# EAGLE schematic uno (EAGLE 6.1)
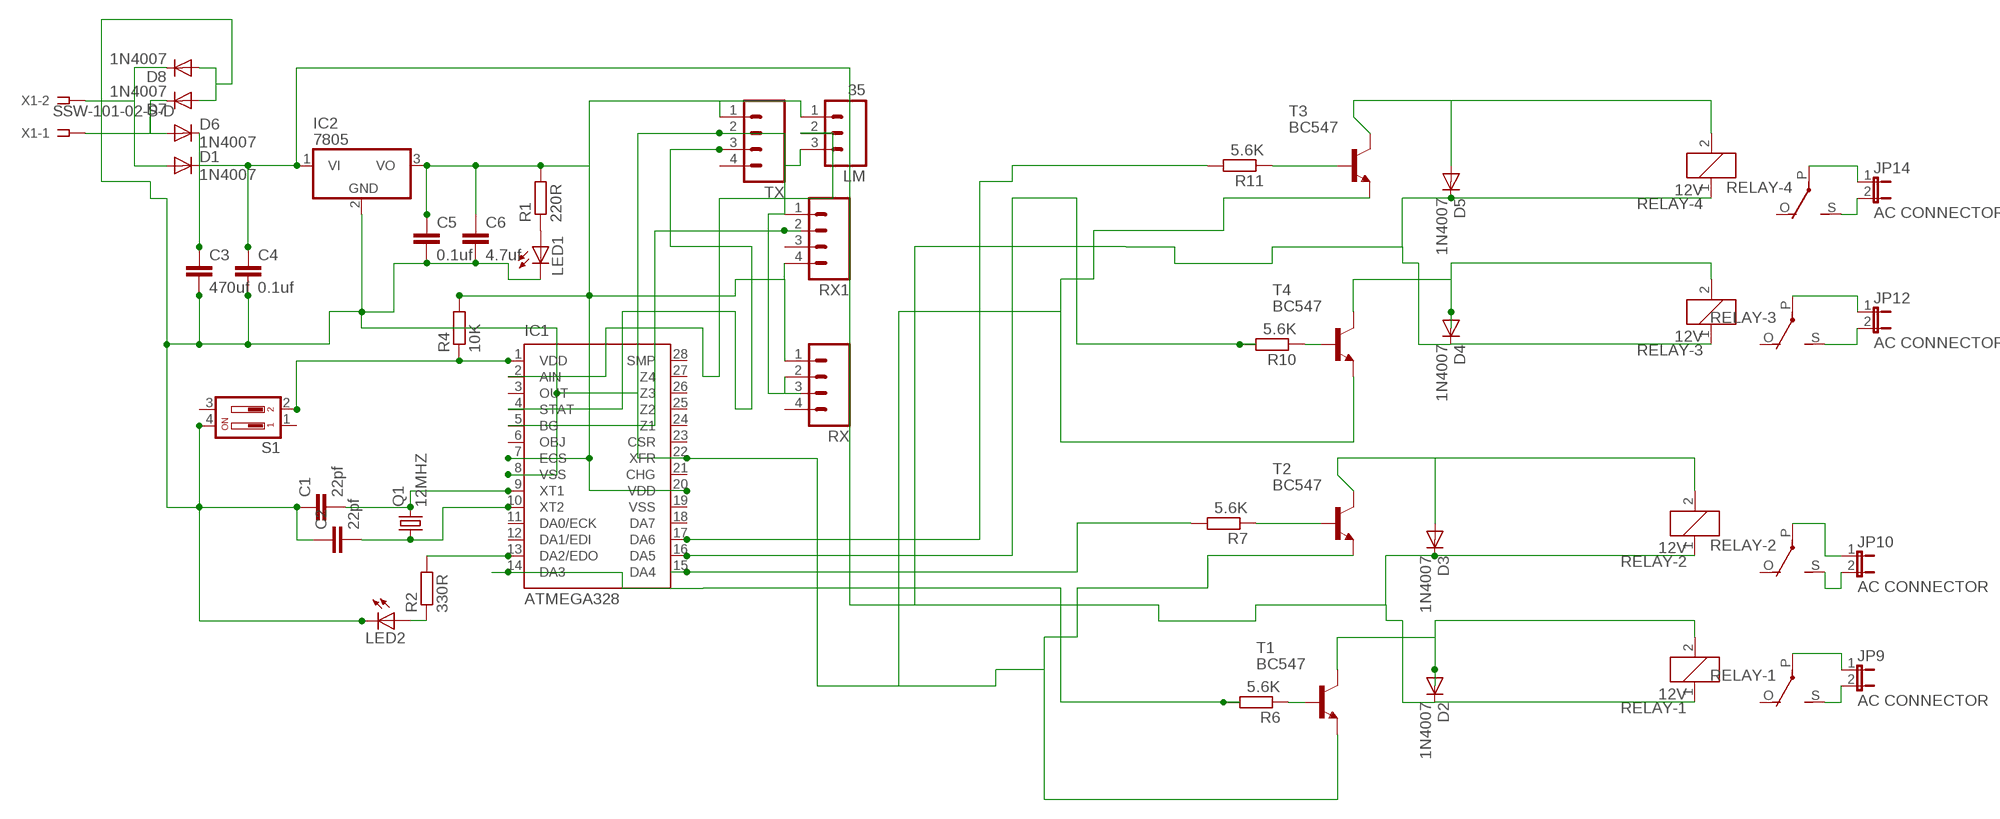
[diagram p0: schematic, sheet 1]

## Parts
C1  22pf  C2.5/2  [C2.5-2]
C2  22pf  C2.5/2  [C2.5-2]
C3  470uf  C2.5/2  [C2.5-2]
C4  0.1uf  C2.5/2  [C2.5-2]
C5  0.1uf  C2.5/2  [C2.5-2]
C6  4.7uf  C2.5/2  [C2.5-2]
D1  1N4007  1N4004  [DO41-10]
D2  1N4007  1N4004  [DO41-10]
D3  1N4007  1N4004  [DO41-10]
D4  1N4007  1N4004  [DO41-10]
D5  1N4007  1N4004  [DO41-10]
D6  1N4007  1N4004  [DO41-10]
D7  1N4007  1N4004  [DO41-10]
D8  1N4007  1N4004  [DO41-10]
IC1  ATMEGA328  QT9701BD  [DIL28-3]
IC2  7805  786TV  [TO220V]
JP9  AC CONNECTOR  JP1E  [JP1]
JP10  AC CONNECTOR  JP1E  [JP1]
JP12  AC CONNECTOR  JP1E  [JP1]
JP14  AC CONNECTOR  JP1E  [JP1]
LED1  LED3MM  [LED3MM]
LED2  LED3MM  [LED3MM]
LM  35  M03  [03P]
Q1  12MHZ  CRYSTALHC49S  [HC49/S]
R1  220R  R-EU_0207/10  [0207/10]
R2  330R  R-EU_0207/10  [0207/10]
R4  10K  R-EU_0207/10  [0207/10]
R6  5.6K  R-EU_0204/7  [0204/7]
R7  5.6K  R-EU_0204/7  [0204/7]
R10  5.6K  R-EU_0204/7  [0204/7]
R11  5.6K  R-EU_0204/7  [0204/7]
RELAY-1  12V  G5L  [G5LE]
RELAY-2  12V  G5L  [G5LE]
RELAY-3  12V  G5L  [G5LE]
RELAY-4  12V  G5L  [G5LE]
RX  M04  [04P]
RX1  M04  [04P]
S1  DP02  [DP-02]
T1  BC547  [TO92]
T2  BC547  [TO92]
T3  BC547  [TO92]
T4  BC547  [TO92]
TX  M04  [04P]
X1  SSW-101-02-S-D  [SSW-101-02-S-D]

## Nets
N$1: C1.2 IC1.9(XT1) Q1.2
N$2: C2.2 IC1.10(XT2) Q1.1
N$4: C5.1 C6.1 IC1.7(ECS) IC1.20(VDD) IC2.3(VO) LM.1 R1.2 R4.2 RX1.4 RX.1 TX.1
N$6: LED1.A R1.1
N$7: C3.1 C4.1 D1.C D2.C D3.C D4.C D5.C D6.C IC2.1(VI) RELAY-1.1 RELAY-2.1 RELAY-3.1 RELAY-4.1
N$8: IC1.2(AIN) LM.2
N$9: IC1.5(BG) RX1.2
N$10: D6.A D7.C X1.1
N$11: IC1.4(STAT) TX.3
N$12: D1.A D8.C X1.2
N$21: IC1.13(DA2/EDO) R2.2
N$28: D2.A RELAY-1.2 T1.3(C)
N$29: R7.1 T2.2(B)
N$30: R6.1 T1.2(B)
N$31: IC1.1(VDD) R4.1 S1.2
N$32: LED2.A R2.1
N$35: JP9.2 RELAY-1.S(2:S)
N$36: JP9.1 RELAY-1.P(2:P)
N$38: JP10.2 RELAY-2.S(2:S)
N$39: JP10.1 RELAY-2.P(2:P)
N$41: IC1.14(DA3) R6.2
N$42: D3.A RELAY-2.2 T2.3(C)
N$43: D4.A RELAY-3.2 T4.3(C)
N$45: R11.1 T3.2(B)
N$46: R10.1 T4.2(B)
N$49: JP12.2 RELAY-3.S(2:S)
N$50: JP12.1 RELAY-3.P(2:P)
N$51: JP14.2 RELAY-4.S(2:S)
N$53: JP14.1 RELAY-4.P(2:P)
N$55: C1.1 C2.1 C3.2 C4.2 C5.2 C6.2 D7.A D8.A IC1.8(VSS) IC1.22(XFR) IC2.2(GND) LED1.K(C) LED2.K(C) LM.3 RX1.1 RX.2 S1.4 T1.1(E) T2.1(E) T3.1(E) T4.1(E) TX.2
N$56: IC1.16(DA5) R10.2
N$57: IC1.17(DA6) R11.2
N$58: D5.A RELAY-4.2 T3.3(C)
N$59: IC1.15(DA4) R7.2
Unconnected: IC1.3(OUT) IC1.6(OBJ) IC1.11(DA0/ECK) IC1.12(DA1/EDI) IC1.18(DA7) IC1.19(VSS) IC1.21(CHG) IC1.23(CSR) IC1.24(Z1) IC1.25(Z2) IC1.26(Z3) IC1.27(Z4) IC1.28(SMP) RELAY-1.O(2:O) RELAY-2.O(2:O) RELAY-3.O(2:O) RELAY-4.O(2:O) RX1.3 RX.3 RX.4 S1.1 S1.3 TX.4

## Library data of the parts
C1-C6 = capacitor-wima:C: CAPACITOR naming: grid - package width
D1-D8 = diode:1N4004: DIODE general purpose rectifier, 1 A
IC1 = quantum-research-group:QT9701B: Charge-Transfer Capacitance Sensor IC Source: http://data.qprox.com/downloads/datasheets/qt9701b.pdf; OC_FARNELL: unknown; OC_NEWARK: unknown
IC2 = linear:78*: Positive VOLTAGE REGULATOR Source: http://cache.national.com/ds/LM/LM78L05.pdf http://www.fairchildsemi.com/ds/LM/LM7805.pdf
JP9 JP10 JP12 JP14 = jumper:JP1E: JUMPER
LED1 LED2 = led:LED: LED OSRAM: - CHIPLED LG R971, LG N971, LY N971, LG Q971, LY Q971, LO R971, LY R971 LH N974, LH R974 LS Q976, LO Q976, LY Q976 LO Q996 - Hyper CHIPLED LW Q18S LB Q993, LB Q99A, LB R99A - SideLED LS A670, LO A670, LY A670, LG A670, LP A670 LB A673, LV A673, LT A673, LW A673 LH A674 LY A675 LS A676, LA A676, LO A676, LY A676, LW A676 LS A679, LY A679, LG A679 - Hyper Micro SIDELED® LS Y876, LA Y876, LO Y876, LY Y876 LT Y87S - SmartLED LW L88C, LW L88S LB L89C, LB L89S, LG L890 LS L89K, LO L89K, LY L89K LS L896, LA L896, LO L896, LY L896 - TOPLED LS T670, LO T670, LY T670, LG T670, LP T670 LSG T670, LSP T670, LSY T670, LOP T670, LYG T670 LG T671, LOG T671, LSG T671 LB T673, LV T673, LT T673, LW T673 LH T674 LS T676, LA T676, LO T676, LY T676, LB T676, LH T676, LSB T676, LW T676 LB T67C, LV T67C, LT T67C, LS T67K, LO T67K, LY T67K, LW E67C LS E67B, LA E67B, LO E67B, LY E67B, LB E67C, LV E67C, LT E67C LW T67C LS T679, LY T679, LG T679 LS T770, LO T770, LY T770, LG T770, LP T770 LB T773, LV T773, LT T773, LW T773 LH T774 LS E675, LA E675, LY E675, LS T675 LS T776, LA T776, LO T776, LY T776, LB T776 LHGB T686 LT T68C, LB T68C - Hyper Mini TOPLED® LB M676 - Mini TOPLED Santana® LG M470 LS M47K, LO M47K, LY M47K Source: http://www.osram.convergy.de LUXEON: - LUMILED® LXK2-PW12-R00, LXK2-PW12-S00, LXK2-PW14-U00, LXK2-PW14-V00 LXK2-PM12-R00, LXK2-PM12-S00, LXK2-PM14-U00 LXK2-PE12-Q00, LXK2-PE12-R00, LXK2-PE12-S00, LXK2-PE14-T00, LXK2-PE14-U00 LXK2-PB12-K00, LXK2-PB12-L00, LXK2-PB12-M00, LXK2-PB14-N00, LXK2-PB14-P00, LXK2-PB14-Q00 LXK2-PR12-L00, LXK2-PR12-M00, LXK2-PR14-Q00, LXK2-PR14-R00 LXK2-PD12-Q00, LXK2-PD12-R00, LXK2-PD12-S00 LXK2-PH12-R00, LXK2-PH12-S00 LXK2-PL12-P00, LXK2-PL12-Q00, LXK2-PL12-R00 Source: www.luxeon.com KINGBRIGHT: KA-3528ASYC Source: www.kingbright.com
LM = con-amp-quick:M03: AMP QUICK CONNECTOR; OC_FARNELL: unknown; OC_NEWARK: unknown
Q1 = crystal:CRYSTAL: CRYSTAL; OC_FARNELL: 1667008; OC_NEWARK: unknown
R1 R2 R4 R6 R7 R10 R11 = rcl:R-EU_: RESISTOR, European symbol
RELAY-1-RELAY-4 = relay:G5L: RELAY 1 x switch, 10 A/120 V AC, 8 A/30 V ADC, Omron; OC_FARNELL: unknown; OC_NEWARK: unknown
RX RX1 TX = con-amp-quick:M04: AMP QUICK CONNECTOR; OC_FARNELL: unknown; OC_NEWARK: unknown
S1 = switch-dil:DP02: DIL/CODE SWITCH; MPN: MCDP02; OC_FARNELL: 1255233; OC_NEWARK: 26M1095
T1-T4 = transistor:BC547: NPN TRANSISTOR
X1 = con-samtec:SSW-101-02-S-D: THROUGH-HOLE .025" SQ POST SOCKET Source: Samtec SSW.pdf; MPN: SSW-101-02-S-D; OC_FARNELL: unknown; OC_NEWARK: 82P1456